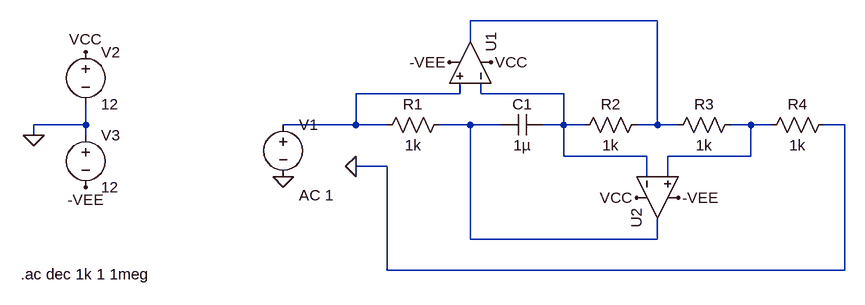
[diagram p0: schematic EJE5_A.asc]
EJE5_A.asc, the LTspice schematic file:
Version 4
SHEET 1 880 680
WIRE 384 16 96 16
WIRE 96 48 96 16
WIRE 80 128 80 112
WIRE 80 128 -80 128
WIRE 112 128 112 112
WIRE 240 128 112 128
WIRE -496 176 -496 144
WIRE -496 176 -576 176
WIRE -80 176 -80 128
WIRE -80 176 -192 176
WIRE -32 176 -80 176
WIRE 96 176 48 176
WIRE 144 176 96 176
WIRE 240 176 240 128
WIRE 240 176 208 176
WIRE 272 176 240 176
WIRE 384 176 384 16
WIRE 384 176 352 176
WIRE 416 176 384 176
WIRE 528 176 496 176
WIRE 560 176 528 176
WIRE 672 176 640 176
WIRE -576 192 -576 176
WIRE -496 192 -496 176
WIRE 240 224 240 176
WIRE 368 224 240 224
WIRE 528 224 528 176
WIRE 528 224 400 224
WIRE -32 240 -80 240
WIRE 368 256 368 224
WIRE 400 256 400 224
WIRE 96 352 96 176
WIRE 384 352 384 320
WIRE 384 352 96 352
WIRE -32 400 -32 240
WIRE 672 400 672 176
WIRE 672 400 -32 400
FLAG -80 240 0
FLAG -192 256 0
FLAG -576 192 0
FLAG -496 64 VCC
FLAG -496 272 -VEE
FLAG 128 80 VCC
FLAG 352 288 VCC
FLAG 64 80 -VEE
FLAG 416 288 -VEE
SYMBOL res 64 160 R90
WINDOW 0 0 56 VBottom 2
WINDOW 3 32 56 VTop 2
SYMATTR InstName R1
SYMATTR Value 1k
SYMBOL cap 208 160 R90
WINDOW 0 0 32 VBottom 2
WINDOW 3 32 32 VTop 2
SYMATTR InstName C1
SYMATTR Value 1µ
SYMBOL OpAmps\\UniversalOpamp2 96 80 M270
SYMATTR InstName U1
SYMBOL res 368 160 R90
WINDOW 0 0 56 VBottom 2
WINDOW 3 32 56 VTop 2
SYMATTR InstName R2
SYMATTR Value 1k
SYMBOL res 512 160 R90
WINDOW 0 0 56 VBottom 2
WINDOW 3 32 56 VTop 2
SYMATTR InstName R3
SYMATTR Value 1k
SYMBOL OpAmps\\UniversalOpamp2 384 288 M90
SYMATTR InstName U2
SYMBOL res 656 160 R90
WINDOW 0 0 56 VBottom 2
WINDOW 3 32 56 VTop 2
SYMATTR InstName R4
SYMATTR Value 1k
SYMBOL voltage -192 160 R0
WINDOW 123 24 124 Left 2
SYMATTR InstName V1
SYMATTR Value ""
SYMATTR Value2 AC 1
SYMBOL voltage -496 48 R0
WINDOW 123 0 0 Left 0
WINDOW 39 0 0 Left 0
SYMATTR InstName V2
SYMATTR Value 12
SYMBOL voltage -496 176 R0
WINDOW 123 0 0 Left 0
WINDOW 39 0 0 Left 0
SYMATTR InstName V3
SYMATTR Value 12
TEXT -596 406 Left 2 !.ac dec 1k 1 1meg

The netlist it stands for:
* EJE5_A.asc
R1 N004 N002 1k
C1 N003 N004 1µ
XU1 N002 N003 VCC -VEE N001 level.2 Avol=1Meg GBW=10Meg Slew=10Meg ilimit=25m rail=0 Vos=0 phimargin=45 en=0 enk=0 in=0 ink=0 Rin=500Meg  ; pins IN+ IN- V+ V- OUT
R2 N001 N003 1k
R3 N005 N001 1k
XU2 N005 N003 VCC -VEE N004 level.2 Avol=1Meg GBW=10Meg Slew=10Meg ilimit=25m rail=0 Vos=0 phimargin=45 en=0 enk=0 in=0 ink=0 Rin=500Meg  ; pins IN+ IN- V+ V- OUT
R4 0 N005 1k
V1 N002 0 AC 1
V2 VCC 0 12
V3 0 -VEE 12
.ac dec 1k 1 1meg
.lib UniversalOpamps2.sub
.backanno
.end